# EAGLE schematic asdf (EAGLE 9.6.2)
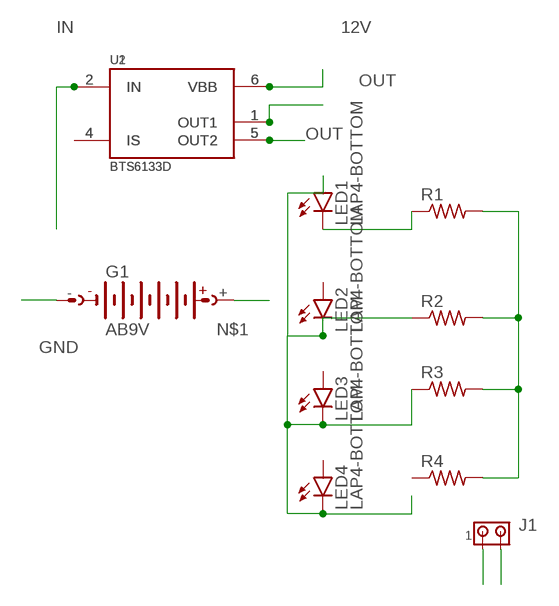
[diagram p0: schematic, sheet 1]

## Parts
G1  AB9V  [AB9V]
J1  MTA02-100  [10X02MTA]
LED1  LAP4-BOTTOM  [P47F-BOTTOM]
LED2  LAP4-BOTTOM  [P47F-BOTTOM]
LED3  LAP4-BOTTOM  [P47F-BOTTOM]
LED4  LAP4-BOTTOM  [P47F-BOTTOM]
R1  R-US_0207/10  [0207/10]
R2  R-US_0207/10  [0207/10]
R3  R-US_0207/10  [0207/10]
R4  R-US_0207/10  [0207/10]
U1  BTS6133D  [TO114P998X235-6_5N-V]
U2  BTS6133D  [TO114P998X235-6_5N-V]

## Nets
12V: U1.6(VBB) U2.6(VBB)
GND: G1.-
IN: U1.2(IN) U2.2(IN)
N$1: G1.+
N$2: U1.4(IS) U2.4(IS)
N$3: R1.2 R2.2 R3.2 R4.2
N$4: J1.2
N$5: J1.1
N$6: LED1.C R1.1
N$9: LED1.A LED2.C LED3.C LED4.C R2.1 R3.1
OUT: U1.1(OUT1) U1.5(OUT2) U2.1(OUT1) U2.5(OUT2)
Unconnected: LED2.A LED3.A LED4.A R4.1

## Library data of the parts
G1 = battery:AB9V: 9-V BATTERY CLIP
J1 = con-amp:MTA02-100: AMP connector
LED1-LED4 = led:*P4: PointLED® Enhanced Thinfilm LED TOP & BOTTOM mount LS P47F, LR P47F, LA P47F, LY P47F, LT P4SG, LB P4SG, LW P4SG Source: http://catalog.osram-os.com .. LA_LR_LS_LY_P47F_Pb_free.pdf
R1-R4 = rcl:R-US_: RESISTOR, American symbol; SPICEPREFIX: R
U1 U2 = BTS6133D:BTS6133D: BTS6133D Smart High-Side Power Switch, Supply Voltage 38V TO114P998X235-6_5N-V